# Altium schematic sheet 3V3-CAN.SchDoc
size A4; Organization: UNSW Solar Racing Team; Address3: UNSW; Address4: Sydney NSW 2052; Address2: Electrical Engineering; Address1: Rm 109
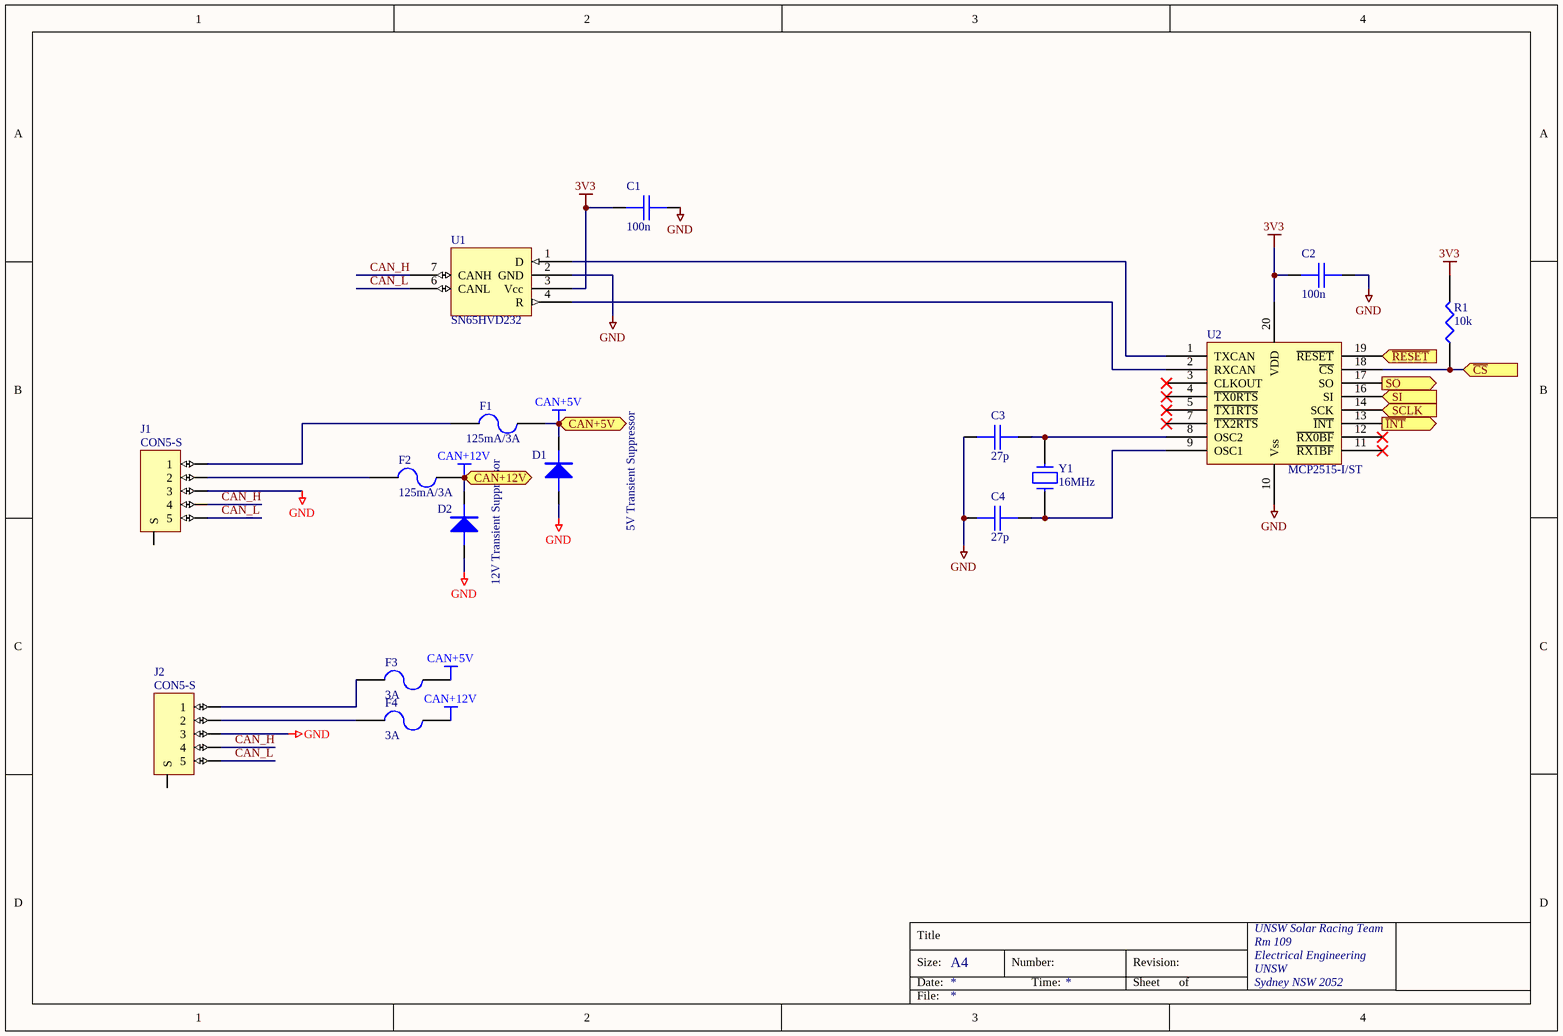
[diagram p0: 3V3-CAN.SchDoc]

## Parts
C1  100n  [0603]
C2  100n  [0603]
C3  27p  [0603]
C4  27p  [0603]
D1  5V Transient Suppressor  [SMA]
D2  12V Transient Suppressor  [SMA]
F1  125mA/3A  [LITTELFUSE-154]
F2  125mA/3A  [LITTELFUSE-154]
F3  3A  [LITTELFUSE-154]
F4  3A  [LITTELFUSE-154]
J1  CON5-S  [TRIAD5F]
J2  CON5-S  [TRIAD5F]
R1  10k  [0603]
U1  SN65HVD232  [SO8]
U2  MCP2515-I/ST  [TSSOP20]
Y1  16MHz  [HC49/4H]

## Ports
CAN+5V (bidir), CAN+12V (bidir), SCLK (in), SI (in), SO (out), ~{CS} (in), ~{INT} (out), ~{RESET} (in)

## Nets
3V3: C1.2 C2.1 R1.2 U1.3(Vcc) U2.20(VDD)
CAN+5V: D1.K F1.2 F3.2 ; port CAN+5V
CAN+12V: D2.K F2.2 F4.2 ; port CAN+12V
GND: C1.1 C2.2 C3.1 C4.1 D1.A D2.A J1.3 J2.3 U1.2(GND) U2.10(Vss)
~{CS}: R1.1 U2.18(~{CS}) ; port ~{CS}
CAN_H: J1.4 J2.4 U1.7(CANH)
CAN_L: J1.5 J2.5 U1.6(CANL)
~{INT}: U2.13(~{INT}) ; port ~{INT}
~{RESET}: U2.19(~{RESET}) ; port ~{RESET}
SCLK: U2.14(SCK) ; port SCLK
SI: U2.16(SI) ; port SI
SO: U2.17(SO) ; port SO
NetC3_2: C3.2 U2.8(OSC2) Y1.1
NetC4_2: C4.2 U2.9(OSC1) Y1.2
NetF1_1: F1.1 J1.1
NetF2_1: F2.1 J1.2
NetF3_1: F3.1 J2.1
NetF4_1: F4.1 J2.2
NetU1_1: U1.1(D) U2.1(TXCAN)
NetU1_4: U1.4(R) U2.2(RXCAN)

Not connected (* = marked no-connect by the designer): J1 0(S); J2 0(S); U2 3(CLKOUT)* 4(~{TX0RTS})* 5(~{TX1RTS})* 7(~{TX2RTS})* 11(~{RX1BF})* 12(~{RX0BF})*

## Notes on the sheet
- Title
- Size:
- Date:
- A4
- Number:
- Time:
- Revision:
- Sheet
- of
- File:

## Library data of the parts
C1 = CAP: Capacitor; something: 0.31; Note: Purchase a reel.; Farnell: 753-567; Price: 0.30
C2 = CAP: Capacitor; something: 0.31; note: Purchase a reel.; Farnell: 753-567; Price: 0.30
C3 C4 = CAP: Capacitor; Farnell - 15pF: 721-980; Farnell: 722-017; Price: 0.30
D1 D2 = DIODE
  D1: Farnell: 1467627; FarnellPrice: 0.538; Digikey: 497-2999-1-ND; DigikeyPrice: 0.60
  D2: Farnell: 9802754; FarnellPrice: 1.20; Digikey: 497-6503-1-ND; DigikeyPrice: 0.56
F1-F4 = FUSE2: Fuse; Farnell: 154-375T (Holder + 125mA fuse) AND 0454 003 (3A Fuse); Price: 4.00
J1 J2 = CON5-S: Connector, 2 pin, with shield @ S; Farnell: 131-040; Price: 16.79
R1 = RES1: Farnell: 612-601; Price: 0.11
U1 = SN65HVD232: 3.3V CAN Transciever; Part Field 2: 5.00; Part Field 3: www.ti.com - Texas Instruments; Farnell: NA
U2 = MCP2515X/ST: MCP2510 CAN Controller; Farnell: 1196851; FarnellPrice: 4.78; Digikey: MCP2515-I/ST-ND; DigikeyPrice: 3.28
Y1 = CRYSTAL: Farnell: 9713700; Price: 2.31; Digikey: X1071-ND; DigikeyPrice: 0.58